# EAGLE design espbot (EAGLE 8.6.0)
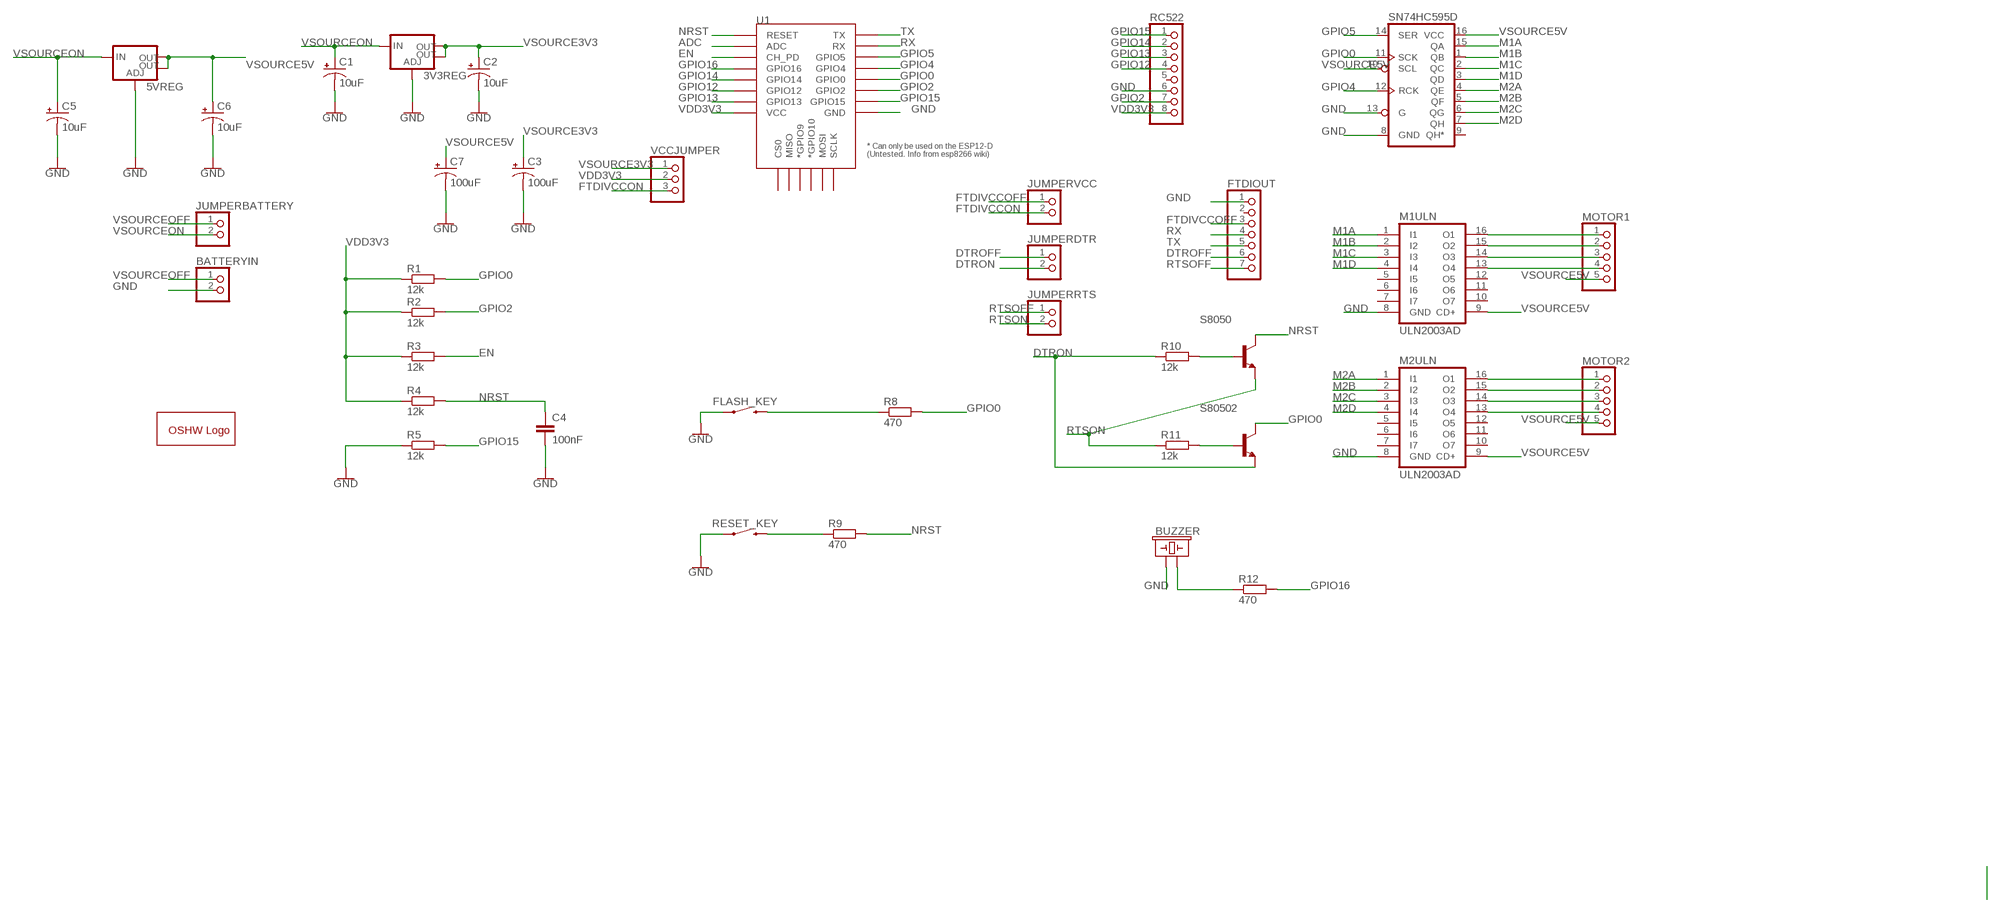
[diagram p0: schematic, sheet 1]

## Parts
3V3REG  V_REG_LM1117SOT223  [SOT223]
5VREG  V_REG_LM1117SOT223  [SOT223]
BATTERYIN  PINHD-1X2  [1X02]
BUZZER  BUZZER-PTH  [BUZZER-12MM]
C1  10uF  10UF-POLAR-EIA3528-20V-10%(TANT)  [EIA3528]
C2  10uF  10UF-POLAR-EIA3528-20V-10%(TANT)  [EIA3528]
C3  100uF  100UF-POLAR-EIA7343-10V-10%(TANT)  [EIA7343]
C4  100nF  C-EUC0805  [C0805]
C5  10uF  10UF-POLAR-EIA3528-20V-10%(TANT)  [EIA3528]
C6  10uF  10UF-POLAR-EIA3528-20V-10%(TANT)  [EIA3528]
C7  100uF  100UF-POLAR-EIA7343-10V-10%(TANT)  [EIA7343]
FLASH_KEY  MOMENTARY-SWITCH-SPST-PTH-6.0MM  [TACTILE_SWITCH_PTH_6.0MM]
FTDIOUT  PINHD-1X7  [1X07]
GOLD_ORB_SM1  OSHWLOGOLOGO5MM  [OSHW_5MM]
JUMPERBATTERY  PINHD-1X2  [1X02]
JUMPERDTR  PINHD-1X2  [1X02]
JUMPERRTS  PINHD-1X2  [1X02]
JUMPERVCC  PINHD-1X2  [1X02]
M1ULN  ULN2003AD  [SO16]
M2ULN  ULN2003AD  [SO16]
MOTOR1  PINHD-1X5  [1X05]
MOTOR2  PINHD-1X5  [1X05]
R1  12k  R-EU_R0805  [R0805]
R2  12k  R-EU_R0805  [R0805]
R3  12k  R-EU_R0805  [R0805]
R4  12k  R-EU_R0805  [R0805]
R5  12k  R-EU_R0805  [R0805]
R8  470  R-EU_R0805  [R0805]
R9  470  R-EU_R0805  [R0805]
R10  12k  R-EU_R0805  [R0805]
R11  12k  R-EU_R0805  [R0805]
R12  470  R-EU_R0805  [R0805]
RC522  PINHD-1X8  [1X08]
RESET_KEY  MOMENTARY-SWITCH-SPST-PTH-6.0MM  [TACTILE_SWITCH_PTH_6.0MM]
S8050  92-NPN-TO92-EBC  [TO92-EBC]
S80502  92-NPN-TO92-EBC  [TO92-EBC]
SN74HC595D  74HC595D  [SO16]
U1  ESP12ESMD  [ESP12E-SMD]
VCCJUMPER  PINHD-1X3  [1X03]

## Nets
ADC: U1.ADC
DTROFF: FTDIOUT.6 JUMPERDTR.1
DTRON: JUMPERDTR.2 R10.1 S80502.E
EN: R3.2 U1.CH_PD
FTDIVCCOFF: FTDIOUT.3 JUMPERVCC.1
FTDIVCCON: JUMPERVCC.2 VCCJUMPER.3
GND: 3V3REG.1(ADJ) 5VREG.1(ADJ) BATTERYIN.2 BUZZER.+ C1.C(-) C2.C(-) C3.C(-) C4.2 C5.C(-) C6.C(-) C7.C(-) FLASH_KEY.1 FTDIOUT.1 M1ULN.8(GND) M2ULN.8(GND) R5.1 RC522.6 RESET_KEY.1 SN74HC595D.8(GND) SN74HC595D.13(G) U1.GND
GPIO0: R1.2 R8.2 S80502.C SN74HC595D.11(SCK) U1.GPIO0
GPIO2: R2.2 RC522.7 U1.GPIO2
GPIO4: SN74HC595D.12(RCK) U1.GPIO4
GPIO5: SN74HC595D.14(SER) U1.GPIO5
GPIO12: RC522.4 U1.GPIO12
GPIO13: RC522.3 U1.GPIO13
GPIO14: RC522.2 U1.GPIO14
GPIO15: R5.2 RC522.1 U1.GPIO15
GPIO16: R12.2 U1.GPIO16
M1A: M1ULN.1(I1) SN74HC595D.15(QA)
M1B: M1ULN.2(I2) SN74HC595D.1(QB)
M1C: M1ULN.3(I3) SN74HC595D.2(QC)
M1D: M1ULN.4(I4) SN74HC595D.3(QD)
M2A: M2ULN.1(I1) SN74HC595D.4(QE)
M2B: M2ULN.2(I2) SN74HC595D.5(QF)
M2C: M2ULN.3(I3) SN74HC595D.6(QG)
M2D: M2ULN.4(I4) SN74HC595D.7(QH)
N$1: FLASH_KEY.3 R8.1
N$2: R9.1 RESET_KEY.3
N$3: R10.2 S8050.B
N$4: R11.2 S80502.B
N$5: BUZZER.- R12.1
N$6: M2ULN.15(O2) MOTOR2.2
N$13: M1ULN.16(O1) MOTOR1.1
N$14: M1ULN.15(O2) MOTOR1.2
N$15: M1ULN.14(O3) MOTOR1.3
N$16: M1ULN.13(O4) MOTOR1.4
N$17: M2ULN.16(O1) MOTOR2.1
N$19: M2ULN.14(O3) MOTOR2.3
N$20: M2ULN.13(O4) MOTOR2.4
NRST: C4.1 R4.2 R9.2 S8050.C U1.RESET
RTSOFF: FTDIOUT.7 JUMPERRTS.1
RTSON: JUMPERRTS.2 R11.1 S8050.E
RX: FTDIOUT.4 U1.RXD0(RX)
TX: FTDIOUT.5 U1.TXD0(TX)
VDD3V3: R1.1 R2.1 R3.1 R4.1 RC522.8 U1.VCC VCCJUMPER.2
VSOURCE3V3: 3V3REG.2(OUT) 3V3REG.4(OUT) C2.A(+) C3.A(+) VCCJUMPER.1
VSOURCE5V: 5VREG.2(OUT) 5VREG.4(OUT) C6.A(+) C7.A(+) M1ULN.9(CD+) M2ULN.9(CD+) MOTOR1.5 MOTOR2.5 SN74HC595D.10(SCL) SN74HC595D.16(VCC)
VSOURCEOFF: BATTERYIN.1 JUMPERBATTERY.1
VSOURCEON: 3V3REG.3(IN) 5VREG.3(IN) C1.A(+) C5.A(+) JUMPERBATTERY.2
Unconnected: FTDIOUT.2 M1ULN.5(I5) M1ULN.6(I6) M1ULN.7(I7) M1ULN.10(O7) M1ULN.11(O6) M1ULN.12(O5) M2ULN.5(I5) M2ULN.6(I6) M2ULN.7(I7) M2ULN.10(O7) M2ULN.11(O6) M2ULN.12(O5) RC522.5 SN74HC595D.9(QH*) U1.CS0 U1.GPIO9(*GPIO9) U1.GPIO10(*GPIO10) U1.MISO U1.MOSI U1.SCLK

## Library data of the parts
3V3REG 5VREG = SparkFun-IC-Power:V_REG_LM1117: Voltage Regulator LM1117 Standard adjustable voltage regulator but in SMD form. Spark Fun Electronics SKU : COM-00595; PROD_ID: VREG-08170
BATTERYIN JUMPERBATTERY JUMPERDTR JUMPERRTS JUMPERVCC = pinhead:PINHD-1X2: PIN HEADER
BUZZER = SparkFun-Electromechanical:BUZZER: Buzzer Small round buzzers that operate around the audible 2kHz range. You can use these as speakers to create simple music or user interfaces. Variant Overview: PTH - Mini Speaker - PC Mount 12mm 2.048kHz <https://www.sparkfun.com/products/7950> PTH_KIT - Mini Speaker - PC Mount 12mm 2.048kHz <https://www.sparkfun.com/products/7950> KIT simplifies soldering by adding stop mask to one side of the pads. PTH_NO_SILK - Mini Speaker - PC Mount 12mm 2.048kHz <https://www.sparkfun.com/products/7950> No silkscreen indicator of buzzer outline. PTH_KIT_NO_SILK - Mini Speaker - PC Mount 12mm 2.048kHz <https://www.sparkfun.com/products/7950> KIT package w/o silkscreen SMD - Buzzer Audio Magnetic (CCV-084B16) SMD buzzer used on, e.g. the LilyPad Buzzer <https://www.sparkfun.com/products/8463> and RFID USB Reader <https://www.sparkfun.com/products/9963>. SMD_KIT - Buzzer Audio Magnetic (CCV-084B16) SMD Buzzer with elongated pins to make soldering easier. Used on the SparkFun Simon Says - Surface Mount Soldering Kit <https://www.sparkfun.com/products/10935>.; PROD_ID: COMP-08253; SF_SKU: COM-07950
C1 C2 C5 C6 = SparkFun-Capacitors:10UF-POLAR: 10.0µF polarized capacitors A capacitor is a passive two-terminal electrical component used to store electrical energy temporarily in an electric field.; PROD_ID: CAP-08063
C3 C7 = SparkFun-Capacitors:100UF-POLAR: 100µF polarized capacitors A capacitor is a passive two-terminal electrical component used to store electrical energy temporarily in an electric field.; PROD_ID: CAP-07890
C4 = resistor:C-EU: CAPACITOR, European symbol
FLASH_KEY RESET_KEY = SparkFun-Switches:MOMENTARY-SWITCH-SPST: Momentary Switch (Pushbutton) - SPST Normally-open (NO) SPST momentary switches (buttons, pushbuttons). Variants PTH-12MM - 12mm square, through-hole Momentary Pushbutton Switch - 12mm Square <https://www.sparkfun.com/products/9190> (COM-09190) PTH-6.0MM, PTH-6.0MM-KIT - 6.0mm square, through-hole Mini Pushbutton Switch <https://www.sparkfun.com/products/97> (COM-00097) KIT package intended for soldering kit's - only one side of pads' copper is exposed. PTH-RIGHT-ANGLE-KIT - Right-angle, through-hole Right Angle Tactile Button <https://www.sparkfun.com/products/10791> - Used on SparkFun BigTime Watch Kit <https://www.sparkfun.com/products/11734> SMD-12MM - 12mm square, surface-mount Tactile Button - SMD (12mm) <https://www.sparkfun.com/products/12993> (COM-12993) Used on SparkFun PicoBoard <https://www.sparkfun.com/products/11888> SMD-4.5MM - 4.5mm Square Trackball Switch Used on SparkFun Blackberry Trackballer Breakout <https://www.sparkfun.com/products/13169> SMD-4.6MMX2.8MM - 4.60mm x 2.80mm, surface mount Used on SparkFun SAMD21 Mini Breakout <https://www.sparkfun.com/products/13664> SMD-5.2MM, SMD-5.2-REDUNDANT - 5.2mm square, surface-mount Mini Pushbutton Switch - SMD <https://www.sparkfun.com/products/8720> (COM-08720) Used on Arduino Pro Mini <https://www.sparkfun.com/products/11114> REDUNDANT package connects both switch circuits together SMD-6.0X3.5MM - 6.0 x 3.5mm, surface mount Momentary Reset Switch SMD <https://www.sparkfun.com/products/8229> (COM-08229) SMD-6.2MM-TALL - 6.2mm square, surface mount Tactile Button - SMD (6mm) <https://www.sparkfun.com/products/12992> Used on SparkFun Digital Sandbox <https://www.sparkfun.com/products/12651> SMD-RIGHT-ANGLE - Right-angle, surface mount Used on SparkFun Block for Intel® Edison - Arduino <https://www.sparkfun.com/products/13036>; PROD_ID: SWCH-08441; SF_SKU: COM-00097
FTDIOUT = pinhead:PINHD-1X7: PIN HEADER
GOLD_ORB_SM1 = oshw:OSHWLOGO: The OSHW logo for PCB layout
M1ULN M2ULN = uln-udn:ULN2003A: DRIVER ARRAY
MOTOR1 MOTOR2 = pinhead:PINHD-1X5: PIN HEADER
R1-R5 R8-R12 = resistor:R-EU_: RESISTOR, European symbol
RC522 = pinhead:PINHD-1X8: PIN HEADER
S8050 S80502 = transistor:*-NPN-: NPN Transistror BF959 corrected 2008.03.06
SN74HC595D = SparkFun-IC-Logic:74*595: 8-Bit Shift Register (Serial to Parallel) Datasheet <http://cdn.sparkfun.com/datasheets/BreakoutBoards/MM74HC595.pdf> SparkFun Products SparkFun Shift Register Breakout - 74HC595 <https://www.sparkfun.com/products/10680> (BOB-10680); PROD_ID: IC-07875; VALUE: SN74HC595D
U1 = esp8266modules:ESP12E: ESP12E Module
VCCJUMPER = pinhead:PINHD-1X3: PIN HEADER

## Board
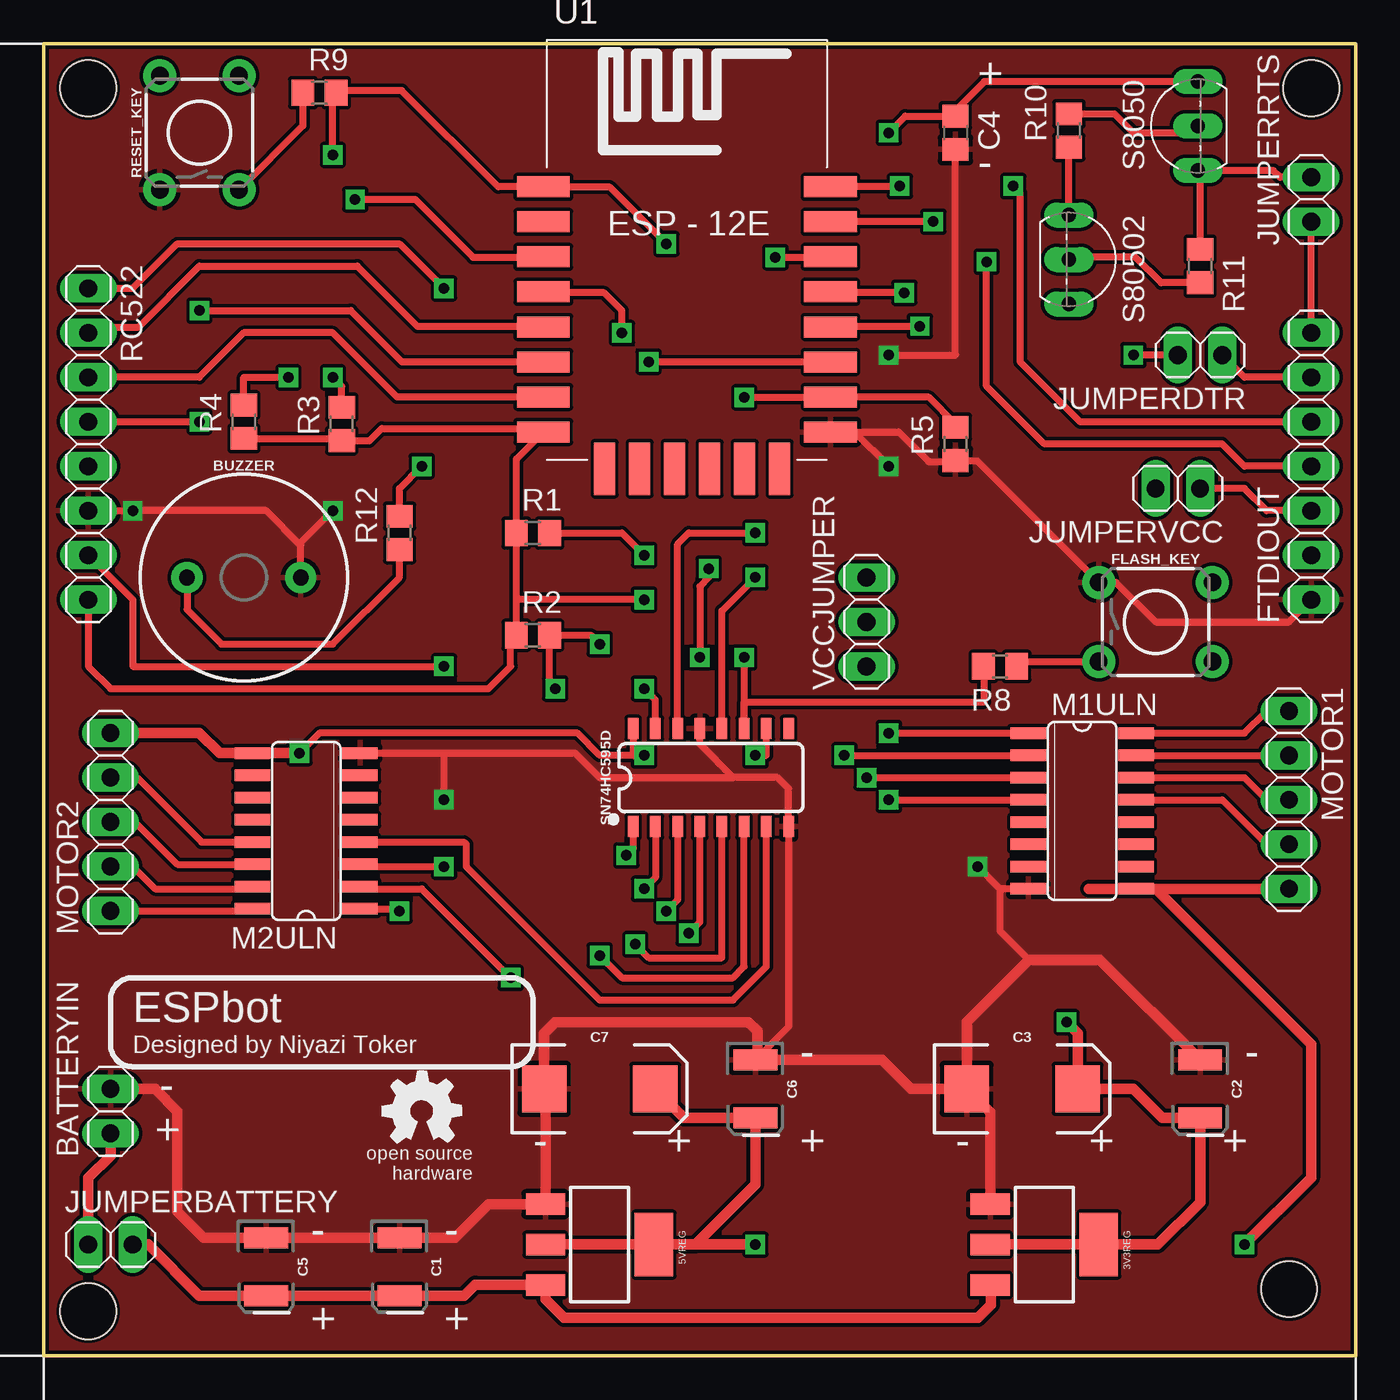
[diagram p1: board, top side]
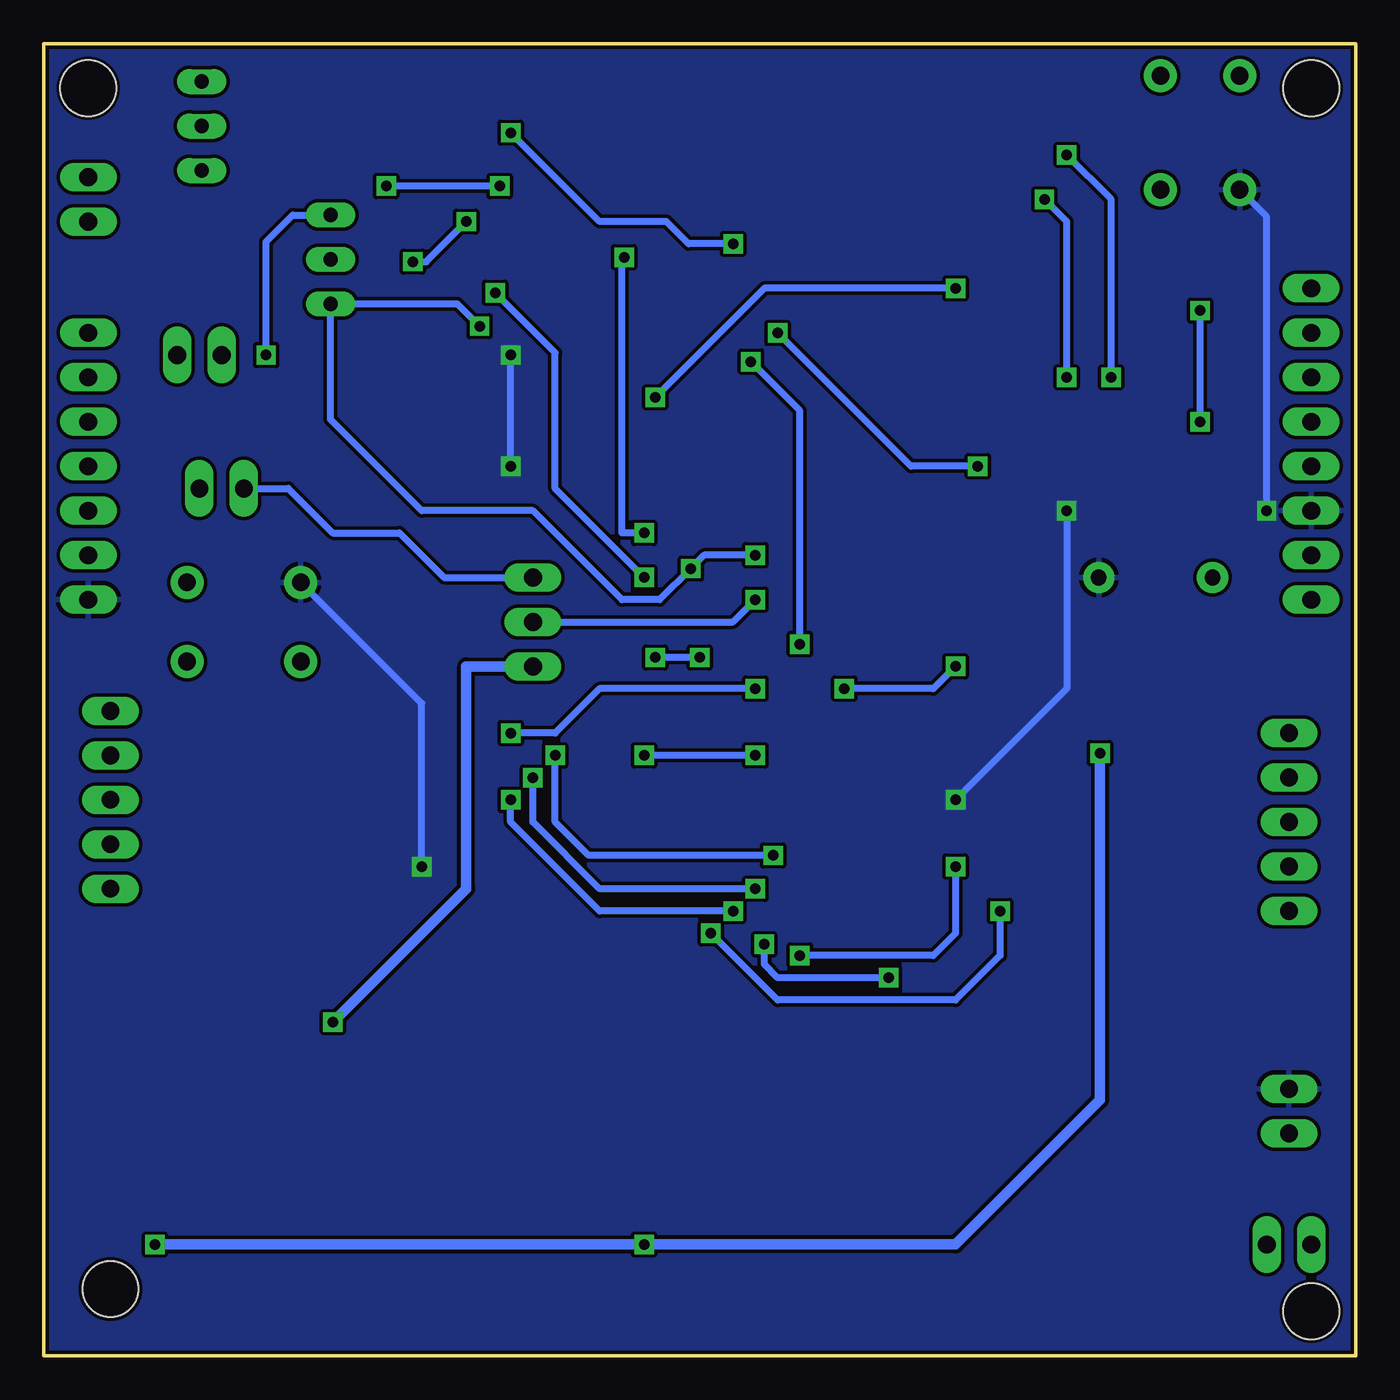
[diagram p2: board, bottom side, seen from below]

Size 74.93 x 74.93 mm. Coordinates in mm from the lower left corner, seen from the top.
Outline: 0,0 0,74.93 74.93,74.93 74.93,0 0,0
Copper layers (1*16): Top 0.035mm / dielectric 1.5mm / Bottom 0.035mm
Design rules "SparkFun": minimum track width 8mil, minimum drill 20mil, track to track 8mil, track to pad 8mil, pad to pad 8mil, via to via 8mil, smd to smd 8mil, copper to edge 8mil, drill to drill 8mil, minimum pad ring 12mil, minimum via ring 10mil, stop-mask expansion 4mil, vias tented up to drill 20mil, thermal gap 10mil
Holes 3.2 mm at 2.54,2.54 71.12,3.81 72.39,72.39 2.54,72.39

### Footprints (pad centres in the part's own frame; a part is rotated, then mirrored left to right if it is on the bottom)
SOT223 = smd 1.219 x 2.235: 1 -2.311,-3.099; 2 0,-3.099; 3 2.311,-3.099 | smd 3.6 x 2.2: 4 0,3.099
1X02 = drill 1.016 long: 1 -1.27,0; 2 1.27,0
BUZZER-12MM = drill 0.9 pad 1.778: + 3.25,0; - -3.25,0
EIA3528 = smd 1.2 x 2.5: A 1.65,0; C -1.65,0
EIA7343 = smd 2.55 x 2.7: A 3.17,0; C -3.17,0
C0805 = smd 1.3 x 1.5: 1 -0.95,0; 2 0.95,0
TACTILE_SWITCH_PTH_6.0MM = drill 1.016 pad 1.88: 1 -3.251,2.261; 2 3.251,2.261; 3 -3.251,-2.261; 4 3.251,-2.261
1X07 = drill 1.016 long: 1 -7.62,0; 2 -5.08,0; 3 -2.54,0; 4 0,0; 5 2.54,0; 6 5.08,0; 7 7.62,0
SO16 = smd 0.66 x 2.032: 1 -4.445,-3.073; 2 -3.175,-3.073; 3 -1.905,-3.073; 4 -0.635,-3.073; 5 0.635,-3.073; 6 1.905,-3.073; 7 3.175,-3.073; 8 4.445,-3.073; 9 4.445,3.073; 10 3.175,3.073; 11 1.905,3.073; 12 0.635,3.073; 13 -0.635,3.073; 14 -1.905,3.073; 15 -3.175,3.073; 16 -4.445,3.073
1X05 = drill 1.016 long: 1 -5.08,0; 2 -2.54,0; 3 0,0; 4 2.54,0; 5 5.08,0
R0805 = smd 1.3 x 1.5: 1 -0.95,0; 2 0.95,0
1X08 = drill 1.016 long: 1 -8.89,0; 2 -6.35,0; 3 -3.81,0; 4 -1.27,0; 5 1.27,0; 6 3.81,0; 7 6.35,0; 8 8.89,0
TO92-EBC = drill 0.813 long: B 0,-1.27; C 2.54,-1.27; E -2.54,-1.27
SO16' = smd 0.6 x 1.2: 1 -4.445,-2.8; 2 -3.175,-2.8; 3 -1.905,-2.8; 4 -0.635,-2.8; 5 0.635,-2.8; 6 1.905,-2.8; 7 3.175,-2.8; 8 4.445,-2.8; 9 4.445,2.8; 10 3.175,2.8; 11 1.905,2.8; 12 0.635,2.8; 13 -0.635,2.8; 14 -1.905,2.8; 15 -3.175,2.8; 16 -4.445,2.8
ESP12E-SMD = smd 3 x 1.2: ADC -8.3,3.8; CH_PD -8.3,1.8; GND 8.1,-8.2; GPIO0 8.1,-2.2; GPIO2 8.1,-4.2; GPIO4 8.1,-0.2; GPIO5 8.1,1.8; GPIO12 -8.3,-4.2; GPIO13 -8.3,-6.2; GPIO14 -8.3,-2.2; GPIO15 8.1,-6.2; GPIO16 -8.3,-0.2; RESET -8.3,5.8; RXD0 8.1,3.8; TXD0 8.1,5.8; VCC -8.3,-8.2 | smd 1.2 x 3: CS0 -4.8,-10.3; GPIO9 -0.8,-10.3; GPIO10 1.2,-10.3; MISO -2.8,-10.3; MOSI 3.2,-10.3; SCLK 5.2,-10.3
1X03 = drill 1.016 long: 1 -2.54,0; 2 0,0; 3 2.54,0

### Placement (x,y rotation side)
3V3REG  57.15,6.35 270 top
5VREG  31.75,6.35 270 top
BATTERYIN  3.81,13.97 90 top
BUZZER  11.43,44.45 0 top
C1  20.32,5.08 270 top
C2  66.04,15.24 270 top
C3  55.88,15.24 0 top
C4  52.07,69.85 270 top
C5  12.7,5.08 270 top
C6  40.64,15.24 270 top
C7  31.75,15.24 0 top
FLASH_KEY  63.5,41.91 0 top
FTDIOUT  72.39,50.8 90 top
GOLD_ORB_SM1  21.59,13.97 0 top
JUMPERBATTERY  3.81,6.35 0 top
JUMPERDTR  66.04,57.15 180 top
JUMPERRTS  72.39,66.04 90 top
JUMPERVCC  64.77,49.53 180 top
M1ULN  59.31,31.11 270 top
M2ULN  14.99,29.97 90 top
MOTOR1  71.12,31.75 270 top
MOTOR2  3.81,30.48 90 top
R1  27.94,46.99 0 top
R2  27.94,41.15 0 top
R3  17.02,53.21 90 top
R4  11.43,53.34 90 top
R5  52.07,52.07 90 top
R8  54.61,39.37 180 top
R9  15.75,72.14 0 top
R10  58.55,69.98 90 top
R11  66.04,62.23 270 top
R12  20.32,46.99 90 top
RC522  2.54,52.07 270 top
RESET_KEY  8.89,69.85 90 top
S8050  64.64,70.23 90 top
S80502  59.82,62.61 270 top
SN74HC595D  [SO16']  38.1,33.02 0 top
U1  36.83,60.96 0 top
VCCJUMPER  46.99,41.91 90 top

### Tracks (layer width: path | path; a pad name or v marks a point on that pad's centre or on a via)
DTROFF
  Top 0.406: FTDIOUT.6 68.58,55.88 JUMPERDTR.1
DTRON  (via drill 0.6)
  Top 0.406: S80502.E R10.1 | JUMPERDTR.2 v62.23,57.15
  Bottom 0.406: v62.23,57.15 62.23,63.63 60.71,65.15 S80502.E
EN  (via drill 0.6)
  Top 0.406: R3.2 17.02,55.37 v16.51,55.88 | v17.78,66.04 21.21,66.04 24.51,62.74 28.51,62.74 U1.CH_PD
  Bottom 0.406: v16.51,55.88 16.51,64.77 v17.78,66.04
FTDIVCCOFF
  Top 0.406: FTDIOUT.3 69.85,48.26 68.58,49.53 JUMPERVCC.1
FTDIVCCON
  Bottom 0.406: JUMPERVCC.2 60.96,49.53 58.42,46.99 54.61,46.99 52.07,44.45 VCCJUMPER.3
GND  (via drill 0.6)
  Top 0.406: C6.C 42.55,18.8 SN74HC595D.8 42.55,32.38 41.91,33.02 39.37,33.02 | 39.37,33.02 37.47,34.92 SN74HC595D.13 | M2ULN.8 22.86,34.42 | 22.86,34.42 30.35,34.42 31.75,33.02 39.37,33.02 | 54.61,26.67 54.61,24.26 56.26,22.61 | RC522.6 v5.08,48.26 12.7,48.26 14.68,46.28 BUZZER.+ 14.68,46.43 v16.51,48.26 | v22.86,31.75 22.86,34.42 | M1ULN.8 54.61,26.67 | 54.61,26.67 v53.34,27.94 | FTDIOUT.1 71.12,41.91 63.5,41.91 61.24,44.17 FLASH_KEY.1 53.3,51.12 R5.1 52,51.05 50.55,51.05 48.84,52.76 U1.GND 46.3,52.76 v48.26,50.8 | v48.26,57.15 52.07,57.15 C4.2
  Top 0.61: BATTERYIN.2 6.35,15.24 7.62,13.97 7.62,8.26 9.14,6.73 C5.C C1.C 23.49,6.73 25.4,8.64 28.96,8.64 29.21,8.89 28.88,8.89 5VREG.1 28.65,15.17 C7.C 28.58,18.42 29.21,19.05 40.26,19.05 40.77,18.54 40.77,17.02 C6.C 47.88,16.89 49.53,15.24 C3.C | 3V3REG.1 54.05,13.9 C3.C | C3.C 52.71,19.05 56.26,22.61 60.32,22.61 C2.C
  Bottom 0.406: v5.08,48.26 5.08,65.05 RESET_KEY.1 | v16.51,48.26 16.51,38.1 v22.86,31.75 | v53.34,27.94 53.34,37.26 FLASH_KEY.1 | v48.26,50.8 v48.26,57.15
  pour Top: 0,0 0,74.93 74.93,74.93 74.93,0
  pour Bottom: 0,0 0,74.93 74.93,74.93 74.93,0
GPIO0  (via drill 0.6)
  Top 0.406: R8.2 53.72,39.37 53.72,37.34 40.01,37.34 SN74HC595D.11 v40.01,39.88 | R1.2 33.02,46.99 v34.29,45.72 | v37.97,44.96 37.97,44.45 37.47,43.94 v37.47,39.88 | U1.GPIO0 44.97,58.8 v50.04,58.8
  Bottom 0.406: v34.29,45.72 37.21,45.72 v37.97,44.96 39.75,43.18 41.91,43.18 46.99,48.26 53.34,48.26 58.55,53.47 S80502.C 51.31,60.07 v50.04,58.8 | v37.47,39.88 v40.01,39.88
GPIO2  (via drill 0.6)
  Top 0.406: RC522.7 5.08,43.18 5.08,39.37 v22.86,39.37 | v29.21,38.1 28.89,38.42 R2.2 31.24,41.15 v31.75,40.64 | v34.54,56.77 U1.GPIO2
  Bottom 0.406: v22.86,39.37 24.13,38.1 v29.21,38.1 | v31.75,40.64 31.75,53.98 v34.54,56.77
GPIO4  (via drill 0.6)
  Top 0.406: SN74HC595D.12 38.73,42.55 v40.64,44.45 | v49.15,60.71 44.98,60.71 U1.GPIO4
  Bottom 0.406: v40.64,44.45 45.72,49.53 45.72,57.28 v49.15,60.71
GPIO5  (via drill 0.6)
  Top 0.406: SN74HC595D.14 36.2,46.35 36.83,46.99 v40.64,46.99 | v41.78,62.74 44.91,62.74 U1.GPIO5
  Bottom 0.406: v40.64,46.99 41.91,46.99 41.91,62.61 v41.78,62.74
GPIO12  (via drill 0.6)
  Top 0.406: RC522.4 v8.89,53.34 | v8.89,59.69 17.53,59.69 20.45,56.77 U1.GPIO12
  Bottom 0.406: v8.89,53.34 v8.89,59.69
GPIO13
  Top 0.406: U1.GPIO13 20.17,54.76 16.51,58.42 11.43,58.42 8.89,55.88 RC522.3
GPIO14
  Top 0.406: 28.19,58.42 U1.GPIO14 28.49,58.8 21.34,58.8 17.91,62.23 8.89,62.23 5.42,58.76 2.88,58.76 RC522.2
GPIO15  (via drill 0.6)
  Top 0.406: RC522.1 5.08,60.96 7.62,63.5 20.32,63.5 v22.86,60.96 | v40.01,54.74 44.91,54.74 U1.GPIO15 44.95,54.74 50.55,54.74 52.07,53.21 R5.2
  Bottom 0.406: v22.86,60.96 33.78,60.96 v40.01,54.74
GPIO16  (via drill 0.6)
  Top 0.406: R12.2 20.32,49.53 v21.59,50.8 | v33.02,58.42 33.02,59.69 32,60.71 28.58,60.71 U1.GPIO16
  Bottom 0.406: v21.59,50.8 25.4,50.8 v33.02,58.42
M1A  (via drill 0.6)
  Top 0.406: SN74HC595D.15 34.92,37.47 v34.29,38.1 | v48.26,35.56 M1ULN.1
  Bottom 0.406: v34.29,38.1 43.18,38.1 45.72,35.56 v48.26,35.56
M1B  (via drill 0.6)
  Top 0.406: SN74HC595D.1 33.66,28.96 v33.27,28.57 | v45.72,34.29 M1ULN.2
  Bottom 0.406: v33.27,28.57 43.81,28.57 45.72,30.48 v45.72,34.29
M1C  (via drill 0.6)
  Top 0.406: SN74HC595D.2 34.92,27.3 v34.29,26.67 | v46.99,33.02 M1ULN.3
  Bottom 0.406: v34.29,26.67 43.18,26.67 46.99,30.48 v46.99,33.02
M1D  (via drill 0.6)
  Top 0.406: SN74HC595D.3 36.2,26.04 v35.56,25.4 | v48.26,31.75 M1ULN.4
  Bottom 0.406: v35.56,25.4 43.18,25.4 48.26,30.48 v48.26,31.75
M2A  (via drill 0.6)
  Top 0.406: M2ULN.1 20.19,25.53 v20.32,25.4 | v36.83,24.13 37.47,24.77 SN74HC595D.4
  Bottom 0.406: v20.32,25.4 20.32,22.86 22.86,20.32 33.02,20.32 v36.83,24.13
M2B  (via drill 0.6)
  Top 0.406: M2ULN.2 18.19,26.67 21.59,26.67 v26.67,21.59 | v33.78,23.5 34.54,22.73 38.73,22.73 SN74HC595D.5
  Bottom 0.406: v26.67,21.59 33.02,21.59 33.78,22.35 v33.78,23.5
M2C  (via drill 0.6)
  Top 0.406: M2ULN.3 18.19,27.94 v22.86,27.94 | v31.75,22.86 33.02,21.59 39.37,21.59 40.01,22.23 SN74HC595D.6
  Bottom 0.406: v22.86,27.94 22.86,24.13 24.13,22.86 v31.75,22.86
M2D
  Top 0.406: M2ULN.4 24,29.34 24.13,29.21 24.13,27.94 31.75,20.32 39.37,20.32 41.27,22.23 SN74HC595D.7
N$1
  Top 0.406: R8.1 55.56,39.65 FLASH_KEY.3
N$2
  Top 0.406: R9.1 14.8,70.25 RESET_KEY.3
N$3
  Top 0.406: R10.2 61.15,70.93 62.23,69.85 65.53,69.85 S8050.B
N$4
  Top 0.406: R11.2 63.81,61.28 62.36,62.74 58.67,62.74 S80502.B
N$5
  Top 0.406: BUZZER.- 8.18,42.62 10.16,40.64 16.51,40.64 20.32,44.45 R12.1
N$6
  Top 0.406: MOTOR2.2 5.08,27.94 6.35,26.67 11.79,26.67 M2ULN.15
N$13
  Top 0.406: M1ULN.16 68.58,35.56 69.85,36.83 MOTOR1.1
N$14
  Top 0.406: M1ULN.15 MOTOR1.2
N$15
  Top 0.406: M1ULN.14 68.58,33.02 69.85,31.75 MOTOR1.3
N$16
  Top 0.406: M1ULN.13 67.31,31.75 69.85,29.21 MOTOR1.4
N$17
  Top 0.406: MOTOR2.1 11.79,25.4 M2ULN.16
N$19
  Top 0.406: MOTOR2.3 5.21,30.48 7.62,28.07 M2ULN.14
N$20
  Top 0.406: MOTOR2.4 5.33,33.02 9.02,29.34 M2ULN.13
NRST  (via drill 0.6)
  Top 0.406: S8050.C 53.72,72.77 52.07,71.12 C4.1 49.21,70.8 v48.26,69.85 | R4.2 11.43,55.88 v13.97,55.88 | v16.51,68.58 16.51,71.95 R9.2 16.82,72.26 20.45,72.26 25.95,66.76 U1.RESET 32.3,66.76 v35.56,63.5
  Bottom 0.406: v13.97,55.88 13.97,66.04 v16.51,68.58 | v35.56,63.5 38.1,63.5 39.37,64.77 43.18,64.77 v48.26,69.85
RTSOFF
  Top 0.406: FTDIOUT.7 JUMPERRTS.1
RTSON
  Top 0.406: JUMPERRTS.2 70.61,67.31 70.23,67.69 S8050.E 66.04,67.56 R11.1
RX  (via drill 0.6)
  Top 0.406: FTDIOUT.4 68.58,50.8 67.31,52.07 57.15,52.07 53.85,55.37 v53.85,62.48 | v50.8,64.77 U1.RXD0
  Bottom 0.406: v53.85,62.48 53.09,62.48 v50.8,64.77
TX  (via drill 0.6)
  Top 0.406: U1.TXD0 44.97,66.8 v48.9,66.8 | v55.37,66.8 55.75,66.42 55.75,56.77 59.18,53.34 FTDIOUT.5
  Bottom 0.406: v48.9,66.8 v55.37,66.8
VDD3V3  (via drill 0.6)
  Top 0.406: RC522.8 2.54,39.37 3.81,38.1 25.4,38.1 26.67,39.37 26.67,40.83 R2.1 26.99,43.18 | 26.99,43.18 R1.1 26.99,51.22 U1.VCC 28.33,52.96 19.3,52.96 18.61,52.26 R3.1 16.89,52.39 R4.1 | v34.29,43.18 26.99,43.18
  Bottom 0.406: VCCJUMPER.2 35.56,41.91 v34.29,43.18
VSOURCE3V3  (via drill 0.6)
  Top 0.61: 3V3REG.2 3V3REG.4 63.63,6.35 66.04,8.76 C2.A 63.88,13.59 62.23,15.24 C3.A 59.05,18.42 v58.42,19.05
  Bottom 0.61: v58.42,19.05 50.8,26.67 50.8,39.37 VCCJUMPER.1
VSOURCE5V  (via drill 0.6)
  Top 0.406: SN74HC595D.16 33.66,34.29 v34.29,34.29 31.75,34.29 30.48,35.56 15.75,35.56 v14.61,34.42 | v40.64,34.29 41.27,34.29 SN74HC595D.10
  Top 0.61: 5VREG.2 5VREG.4 37.21,6.35 | 37.21,6.35 40.64,9.78 C6.A 36.57,13.59 C7.A | MOTOR2.5 8.89,35.56 10.03,34.42 M2ULN.9 v14.61,34.42 | MOTOR1.5 M1ULN.9 | v40.64,6.35 37.21,6.35 | M1ULN.9 59.69,26.67 | M1ULN.9 63.5,26.67 72.39,17.78 72.39,10.16 v68.58,6.35
  Bottom 0.406: v34.29,34.29 v40.64,34.29
  Bottom 0.61: v14.61,34.42 14.61,14.61 22.86,6.35 v40.64,6.35 v68.58,6.35
VSOURCEOFF
  Top 0.61: BATTERYIN.1 3.81,11.43 2.54,10.16 JUMPERBATTERY.1
VSOURCEON
  Top 0.61: JUMPERBATTERY.2 5.97,6.35 8.89,3.43 C5.A C1.A 24,3.43 24.64,4.06 28.63,4.06 5VREG.3 28.65,3.23 29.72,2.16 53.34,2.16 54.1,2.92 54.1,3.99 3V3REG.3

### Text on the board
tPlace: + | - | ESPbot | Designed by Niyazi Toker | - | - | - | + | - | + | + | - | + | + | - | - | + | +
tTest: ESPbot | ESPbot